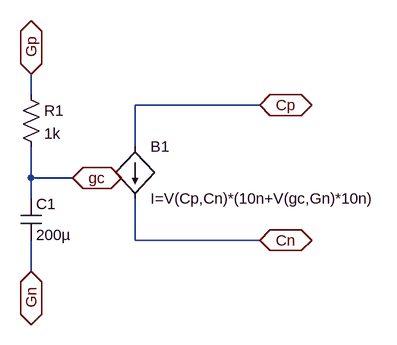
[diagram p0: schematic Capteur_graphite.asc]
Capteur_graphite.asc, the LTspice schematic file:
Version 4
SHEET 1 880 680
WIRE -80 32 -80 0
WIRE 272 48 80 48
WIRE 80 112 80 48
WIRE -80 160 -80 112
WIRE -16 160 -80 160
WIRE -80 192 -80 160
WIRE 80 256 80 192
WIRE 272 256 80 256
WIRE -80 304 -80 256
FLAG 272 48 Cp
IOPIN 272 48 BiDir
FLAG 272 256 Cn
IOPIN 272 256 BiDir
FLAG -16 160 gc
IOPIN -16 160 BiDir
FLAG -80 0 Gp
IOPIN -80 0 BiDir
FLAG -80 304 Gn
IOPIN -80 304 BiDir
SYMBOL bi 80 112 R0
SYMATTR InstName B1
SYMATTR Value I=V(Cp,Cn)*(10n+V(gc,Gn)*10n)
SYMBOL res -96 16 R0
SYMATTR InstName R1
SYMATTR Value 1k
SYMBOL cap -96 192 R0
SYMATTR InstName C1
SYMATTR Value 200µ

The netlist it stands for:
* Capteur_graphite.asc
B1 Cp Cn I=V(Cp,Cn)*(10n+V(gc,Gn)*10n)
R1 Gp gc 1k
C1 gc Gn 200µ
.backanno
.end